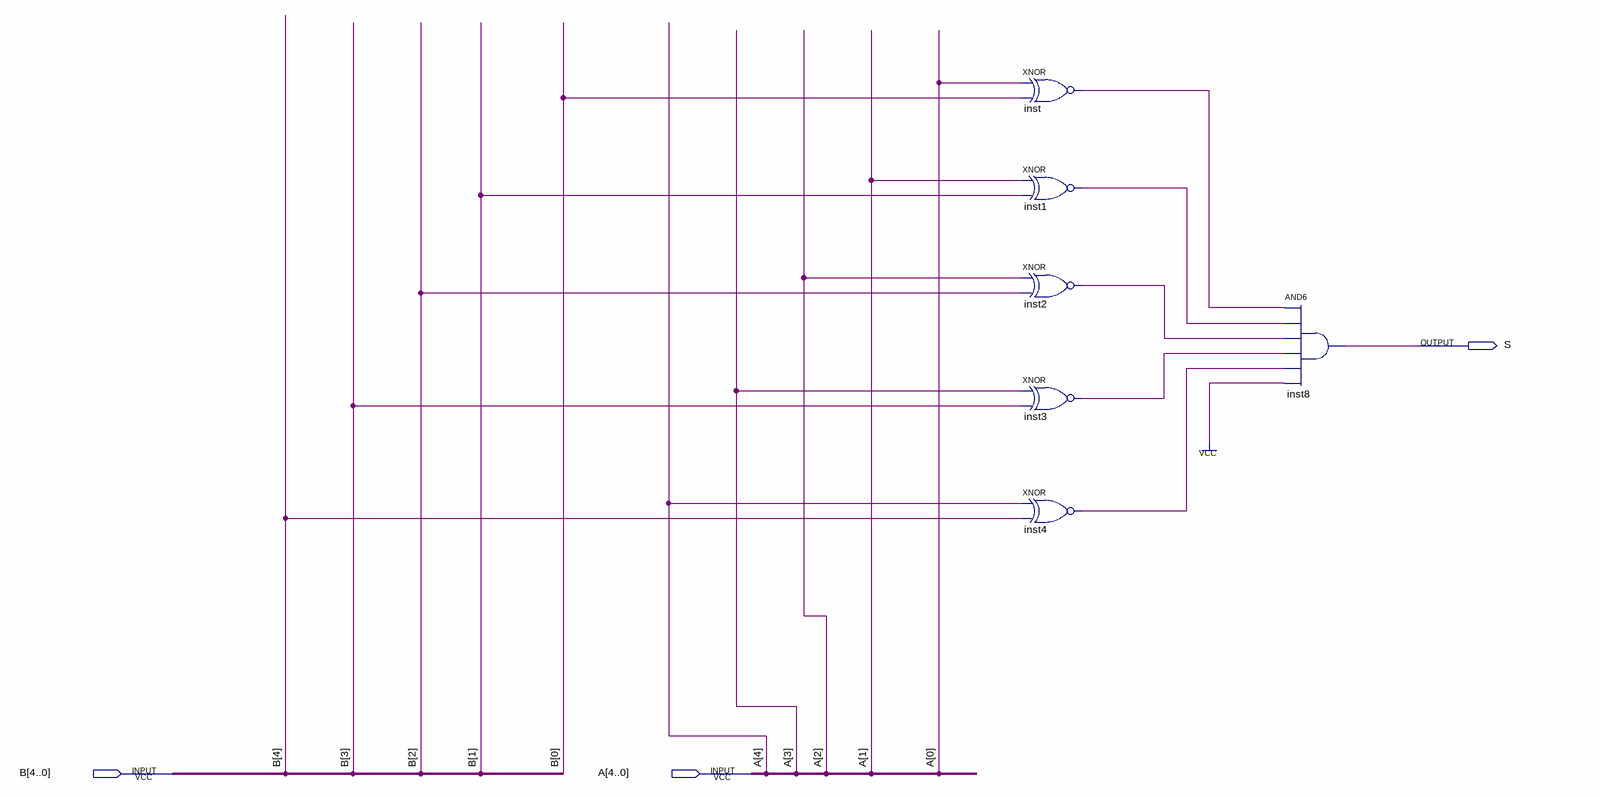
[diagram p0: schematic sheet]
// Quartus schematic aigualb.bdf as structural Verilog: 6 symbols, 3 pins
module aigualb (
  input  [4:0] B,
  input  [4:0] A,
  output S
);

  wire inst1_out, inst2_out, inst3_out, inst4_out, inst_out;

  xnor inst (inst_out, A[0], B[0]);
  xnor inst1 (inst1_out, A[1], B[1]);
  xnor inst2 (inst2_out, A[2], B[2]);
  xnor inst3 (inst3_out, A[3], B[3]);
  xnor inst4 (inst4_out, A[4], B[4]);
  and inst8 (S, inst_out, inst1_out, inst2_out, inst3_out, inst4_out, 1'b1);
endmodule
